# Altium schematic sheet CurrentLimiter.SchDoc
size A4; SheetNumber: 3; SheetTotal: 5
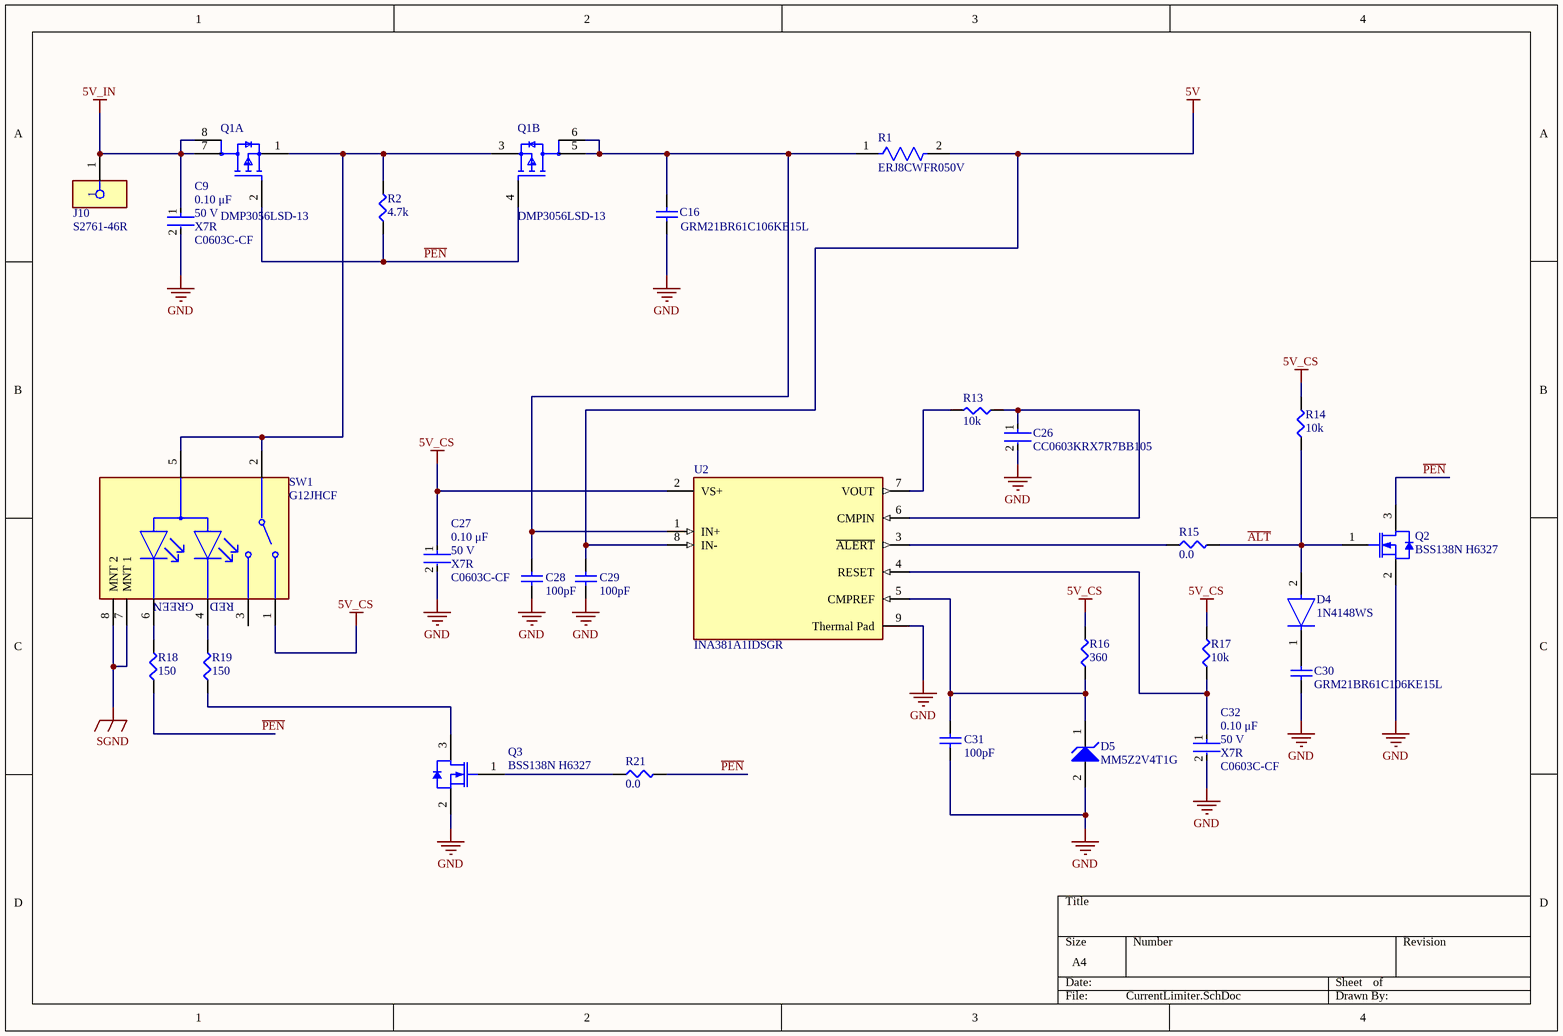
[diagram p0: CurrentLimiter.SchDoc]

## Parts
C9  value 0.10 μF  Package: C0603C-CF  Voltage Rating: 50 V  Temperature Characteristic: X7R  [FP-C0603C-CF-MFG]  (hidden comment: C0603C104K5RACTU)
C16  GRM21BR61C106KE15L  [CAPC2013X135X50LL10T20]
C26  CC0603KRX7R7BB105  [FP-CC0603-DA-MFG]
C27  value 0.10 μF  Package: C0603C-CF  Voltage Rating: 50 V  Temperature Characteristic: X7R  [FP-C0603C-CF-MFG]  (hidden comment: C0603C104K5RACTU)
C28  Capacitance: 100pF  [CAPC1608X90X40ML10T20]  (hidden comment: CC0603JRNPO9BN101)
C29  Capacitance: 100pF  [CAPC1608X90X40ML10T20]  (hidden comment: CC0603JRNPO9BN101)
C30  GRM21BR61C106KE15L  [CAPC2013X135X50LL10T20]
C31  Capacitance: 100pF  [CAPC1608X90X40ML10T20]  (hidden comment: CC0603JRNPO9BN101)
C32  value 0.10 μF  Package: C0603C-CF  Voltage Rating: 50 V  Temperature Characteristic: X7R  [FP-C0603C-CF-MFG]  (hidden comment: C0603C104K5RACTU)
D4  1N4148WS  [FP-477AB-IPC_C]
D5  MM5Z2V4T1G  [ONSC-SOD-523-2-502-01_V]
J10  S2761-46R  [FP-S2761-46R-MFG]
Q1  DMP3056LSD-13  [FP-SO-8-MFG]  (parts A,B of 2)
Q2  BSS138N H6327  [INF-PG-SOT-23-3_V]
Q3  BSS138N H6327  [INF-PG-SOT-23-3_V]
R1  ERJ8CWFR050V  [FP-ERJ8CW-IPC_B]
R2  4.7k  [SMD-0603-RES]
R13  10k  [SMD-0603-RES]
R14  10k  [SMD-0603-RES]
R15  0.0  [SMD-0603-RES]
R16  360  [SMD-0603-RES]
R17  10k  [SMD-0603-RES]
R18  150  [SMD-0603-RES]
R19  150  [SMD-0603-RES]
R21  0.0  [SMD-0603-RES]
SW1  G12JHCF  [FP-G12JHCF-MFG]
U2  INA381A1IDSGR  [FP-DSG0008A-IPC_A]

## Nets
5V: C29.2 R1.2 U2.8(IN-)
5V_CS: C27.1 R14.2 R16.2 R17.2 SW1.1 U2.2(VS+)
5V_IN: C9.1 J10.1 Q1.7(D1) Q1.8(D1)
GND: C9.2 C16.1 C26.2 C27.2 C28.1 C29.1 C30.1 C31.1 C32.2 D5.2(A) Q2.2(SOURCE) Q3.2(SOURCE) U2.9(Thermal_Pad)
SGND: SW1.7(MNT_1) SW1.8(MNT_2)
~{ALT}: D4.2(A) Q2.1(GATE) R14.1 R15.2
~{PEN}: Q1.2(G1) Q1.4(G2) Q2.3(DRAIN) R2.1 R18.1 R21.2
NetC16_2: C16.2 C28.2 Q1.5(D2) Q1.6(D2) R1.1 U2.1(IN+)
NetC26_1: C26.1 R13.1 U2.6(CMPIN)
NetC30_2: C30.2 D4.1(C)
NetC31_2: C31.2 D5.1(K) R16.1 U2.5(CMPREF)
NetC32_1: C32.1 R17.1 U2.4(RESET)
NetQ1_1: Q1.1(S1) Q1.3(S2) R2.2 SW1.2(COM) SW1.5(A)
NetQ3_1: Q3.1(GATE) R21.1
NetQ3_3: Q3.3(DRAIN) R19.1
NetR13_2: R13.2 U2.7(VOUT)
NetR15_1: R15.1 U2.3(~{ALERT})
NetR18_2: R18.2 SW1.6(GREEN_C)
NetR19_2: R19.2 SW1.4(RED_C)

Not connected (* = marked no-connect by the designer): SW1 3

## Notes on the sheet
- (near SW1) GREEN
- (near SW1) RED

## Library data of the parts
C9 C27 C32 = CMP-2006-03061-2: CAP CER 0.1UF 50V X7R 0603; Manufacturer: KEMET; Tolerance: 0.1; Temperature Coefficient: 30ppm/°C; Material: Ceramic; Automotive Grade: Grade 1; Temperature: -55°C to +125°C; RoHS: TRUE; Temperature Range High: +125°C; Lead Free: Yes; Octopart: https://octopart.com/c0603c104k5ractu-kemet-139244; Digikey Description: CAP CER 0.1UF 50V X7R 0603; Category: Cap; ComponentLink2Description: Datasheet; Temperature Range Low: -55°C; Device Class L1: Passive Components; Automotive: Yes; Device Class L3: Ceramic Capacitors; ComponentLink2URL: https://api.kemet.com/component-edge/download/datasheet/C0603C100J5GACAUTO.pdf; Capacitance: 0.10 μF; Device Class L2: Capacitors; Manufacturer Part Number: C0603C104K5RACTU; Height: 0.87mm
C16 C30 = CMP-2007-03453-1: Manufacturer: Murata; Part Number: GRM21BR61C106KE15L
C26 = CMP-03422-000924-1: CAP CER 1UF 16V X7R 0603; Manufacturer: YAGEO; Tolerance: 0.1; Description: CC0603 1 uF X7R 10.00% 16 V; Temperature Coefficient: 15%; Material: Ceramic; Package: CC0603-DA; RoHS: TRUE; Device Class L2: Capacitors; Temperature Characteristic: X7R; Temperature: -55°C to +125°C; Temperature Range Low: -55°C; Automotive: No; ComponentLink2Description: Datasheet; Value: 1 uF; Lead Free: Yes; Capacitance: 1 uF; ComponentLink2URL: http://www.yageo.com/documents/recent/UPY-GPHC_X7R_6.3V-to-50V_18.pdf; Device Class L1: Passive Components; Voltage: 16 V; Octopart: https://octopart.com/cc0603krx7r7bb105-yageo-42271928; Category: Cap; Digikey Description: CAP CER 1UF 16V X7R 0603; Footprint Url: http://www.yageo.com/exep/pages/download/literatures/UPY-C_GEN_24.pdf; Height: 0.9mm; Manufacturer Part Number: CC0603KRX7R7BB105; Voltage Rating: 16 V; Temperature Range High: +125°C; Mouser Description: Multilayer Ceramic Capacitor, CC Series, 1 - F, - 10%, X7R, 16 V, 0603 [1608 Metric]; Device Class L3: Ceramic Capacitors
C28 C29 C31 = CMP-2100-03594-1: Chip Capacitor, 100 pF, +/- 5%, 50 V, -55 to 125 degC, 0603 (1608 Metric), RoHS, Tape and Reel; Manufacturer: Yageo; Voltage Rating (DC): 50V; Dielectric: C0G; Temperature Coefficient: 30ppm/degC; Insulation Resistance: 100GR; Datasheet Version: Rev. 14, 07/2016; Manufacturer URL: http://www.yageo.com/; Packaging: TapeandReel; Mount: SurfaceMount; RoHSCompliant: True; Package Reference: 0603; Tolerance: 5%; Max Operating Temperature: 125degC; Case Code (Imperial): 0603; Number of Pins: 2; Width: 0.8mm; Case Code (Metric): 1608; Voltage: 50V; REACH SVHC: Unknown; Package Description: 2-Pin Surface Mount Device, Body 1.6 x 0.8 mm; Composition: Ceramic; Lead Free: LeadFree; Min Operating Temperature: -55degC; Radiation Hardening: No; Depth: 0.8mm; Thickness: 0.035inch; Datasheet URL: http://www.yageo.com/documents/recent/UPY-GP_NP0_16V-to-50V_14.pdf; Termination: SMD/SMT; Package Quantity: 1; Length: 1.6mm; Voltage Rating: 50V; Height: 0.8mm; Case/Package: 0603
D4 = CMP-07163-000040-1: DIODE GEN PURP 75V 150MA SOD323F; Recovery Time: 4ns; Element Configuration: Single; Max Forward Surge Current (Ifsm): 2A; Power Dissipation: 200mW; Forward Voltage: 1V; Peak Reverse Current: 5uA; Packaging: Tape and Reel; Min Operating Temperature: -55°C; Mount: Surface Mount; REACH SVHC: No SVHC; Lead Free: Lead Free; Length: 1.8mm; Radiation Hardening: No; Contact Plating: Tin; Max Operating Temperature: 150°C; Weight: 0.0276g; Reverse Voltage: 75V; Width: 1.35mm; Max Reverse Voltage (DC): 75V; Average Rectified Current: 150mA; Package Quantity: 1; Max Repetitive Reverse Voltage (Vrrm): 75V; Forward Current: 150mA; Height: 1mm; Reverse Recovery Time: 4ns; Number of Pins: 2
D5 = CMP-1060-00741-1: Zener Voltage Regulator, 500 mW, 2-Pin SOD-523, Pb-Free, Tape and Reel; Manufacturer: On Semiconductor; VZ Typ (V): 2.4; P Max (W): 0.5; DatasheetVersion: Rev. 10; PackageDescription: 2-Pin SOD, Body 1.2 x 0.8 mm; PackageVersion: Rev. E, 09/2010; ComponentLink2Description: Datasheet; ComponentLink1URL: http://www.onsemi.com/; ComponentLink2URL: http://www.onsemi.cn/pub_link/Collateral/MM5Z2V4T1-D.PDF; Mounting Technology: Surface Mount; ComponentLink1Description: Manufacturer URL; PackageReference: SOD-523-2-502-01; PartNumber: MM5Z2V4T1G; ComponentLink3Description: Package Specification; RoHS: Pb-Free; ComponentLink3URL: http://www.onsemi.com/pub_link/Collateral/502-01.PDF; Packing: Tape and Reel
J10 = CMP-15817-000011-1: PC TEST POINT NATURAL; Body Material: Brass; Plating: Tin; Mount: Surface Mount; Material: Copper Alloy; Packaging: Tape and Reel; Color: Natural; RoHS Compliant: Yes
Q1 = CMP-12801-000117-1: MOSFET 2P-CH 30V 6.9A 8-SOIC; Turn-Off Delay Time: 26.5ns; Turn-On Delay Time: 6.4ns; Number of Channels: 2; Drain to Source Resistance: 45mR; Gate to Source Voltage (Vgs): 20V; Max Power Dissipation: 2.5W; Rise Time: 5.3ns; Polarity: P-CHANNEL; Input Capacitance: 722pF; Fall Time: 14.7ns; Lead Free: Lead Free; Package Quantity: 2500; Mount: Surface Mount; Series: -; Height: 1.5mm; Radiation Hardening: No; Power Dissipation: 2.5W; Weight: 0.00261oz; Max Operating Temperature: 150°C; Drain to Source Voltage (Vdss): 30V; Rds On Max: 45mR; RoHS Compliant: Yes; Case/Package: SOP; Number of Elements: 2; Number of Pins: 8; REACH SVHC: No SVHC; Packaging: Tape and Reel; Min Operating Temperature: -55°C; Length: 5.3mm; Continuous Drain Current (ID): 6.9A; Width: 4.1mm
Q2 Q3 = CMP-2000-05967-1: N-Channel Small Signal MOSFET, 60 VDS, 0.23 A, -55 to 150 degC, 3-Pin SOT-23, RoHS, Tape and Reel; Manufacturer: InfineonTechnologiesAmericasInc.; Typical Turn-Off Delay Time: 6.7ns; Maximum Gate Source Voltage: ±20V; RDS-on: 3500@10VmOhm; Maximum Continuous Drain Current: 0.23A; Typical Rise Time: 3ns; Typical Fall Time: 8.2ns; Package Version: 12/2014; Typical Turn-On Delay Time: 2.3ns; Maximum Drain Source Voltage: 60V; Channel Mode: Enhancement; Package: 3SOT-23; Datasheet URL: https://datasheet.ciiva.com/4440/bss138n-rev2-86-88031-4440236.pdf; Manufacturer URL: http://www.infineon.com/; Mounting Technology: SurfaceMount; Datasheet Version: Rev. 2.86, 04/2012; Operating Temperature: -55to150°C; Package Description: 3-Pin Small Outline Transistor, Body 2.9 x 1.3 mm, Pitch 0.95 mm; Category: MOSFET; Package URL: http://www.infineon.com/dgdl/SOT23-Package_Overview.pdf?fileId=db3a30431936bc4b0119533468123c85; Mounting: SurfaceMount; Package Reference: PG-SOT-23-3
R1 = CMP-2003-00803-2: RES 0.05 OHM 1% 1W 1206
R2 = ERJ-3EKF4701V: RES SMD 4.7K OHM 1% 1/10W 0603; Manufacturer: Panasonic Electronic Components; Factory Stock: 0; Unit Price (USD): 0.00379; @ qty: 1500; Minimum Quantity: 1; Power (Watts): 0.1W, 1/10W; Temperature Coefficient: ±100ppm/°C; Part Number: ERJ-3EKF4701V; Datasheets: http://industrial.panasonic.com/www-cgi/jvcr13pz.cgi?E+PZ+3+AOA0002+ERJ3EKF4701V+7+WW; Image: //media.digikey.com/Photos/Panasonic%20Photos/MFG_ERJ-P6W%20Series.jpg; Digi-Key Part Number: P4.70KHCT-ND; Quantity Available: 999380; Packaging: Cut Tape (CT); Series: ERJ; Part Status: Active; Value: 4.7k; Tolerance: ±1%; Composition: Thick Film; Features: Automotive AEC-Q200; Operating Temperature: -55°C ~ 155°C; Package / Case: 0603 (1608 Metric); Supplier Device Package: 0603; Size / Dimension: 0.063" L x 0.031" W (1.60mm x 0.80mm); Height - Seated (Max): 0.022" (0.55mm); Number of Terminations: 2; Failure Rate: -
R13 R14 R17 = ERJ-3EKF1002V: RES SMD 10K OHM 1% 1/10W 0603; Manufacturer: Panasonic Electronic Components; Factory Stock: 0; Unit Price (USD): 0.00379; @ qty: 1500; Minimum Quantity: 1; Power (Watts): 0.1W, 1/10W; Temperature Coefficient: ±100ppm/°C; Part Number: ERJ-3EKF1002V; Datasheets: http://industrial.panasonic.com/www-cgi/jvcr13pz.cgi?E+PZ+3+AOA0002+ERJ3EKF1002V+7+WW; Image: //media.digikey.com/Photos/Panasonic%20Photos/MFG_ERJ-P6W%20Series.jpg; Digi-Key Part Number: P10.0KHCT-ND; Quantity Available: 6703141; Packaging: Cut Tape (CT); Series: ERJ; Part Status: Active; Value: 10k; Tolerance: ±1%; Composition: Thick Film; Features: Automotive AEC-Q200; Operating Temperature: -55°C ~ 155°C; Package / Case: 0603 (1608 Metric); Supplier Device Package: 0603; Size / Dimension: 0.063" L x 0.031" W (1.60mm x 0.80mm); Height - Seated (Max): 0.022" (0.55mm); Number of Terminations: 2; Failure Rate: -
R15 R21 = ERJ-3GEY0R00V: RES SMD 0.0OHM JUMPER 1/10W 0603; Manufacturer: Panasonic Electronic Components; Factory Stock: 0; Unit Price (USD): 0.00352; @ qty: 1500; Minimum Quantity: 1; Power (Watts): 0.1W, 1/10W; Part Number: ERJ-3GEY0R00V; Datasheets: http://industrial.panasonic.com/www-cgi/jvcr13pz.cgi?E+PZ+3+AOA0001+ERJ3GEY0R00V+7+WW; Image: //media.digikey.com/Photos/Panasonic%20Photos/MFG_ERJ-P6W%20Series.jpg; Digi-Key Part Number: P0.0GCT-ND; Quantity Available: 4813372; Packaging: Cut Tape (CT); Series: ERJ; Part Status: Active; Value: 0.0; Tolerance: Jumper; Composition: Thick Film; Features: Automotive AEC-Q200; Temperature Coefficient: -; Operating Temperature: -55°C ~ 155°C; Package / Case: 0603 (1608 Metric); Supplier Device Package: 0603; Size / Dimension: 0.063" L x 0.031" W (1.60mm x 0.80mm); Height - Seated (Max): 0.022" (0.55mm); Number of Terminations: 2; Failure Rate: -
R16 = ERJ-3EKF3600V: RES SMD 360 OHM 1% 1/10W 0603; Manufacturer: Panasonic Electronic Components; Factory Stock: 0; Unit Price (USD): 0.00379; @ qty: 1500; Minimum Quantity: 1; Power (Watts): 0.1W, 1/10W; Temperature Coefficient: ±100ppm/°C; Part Number: ERJ-3EKF3600V; Datasheets: http://industrial.panasonic.com/www-cgi/jvcr13pz.cgi?E+PZ+3+AOA0002+ERJ3EKF3600V+7+WW; Image: //media.digikey.com/Photos/Panasonic%20Photos/MFG_ERJ-P6W%20Series.jpg; Digi-Key Part Number: P360HCT-ND; Quantity Available: 85954; Packaging: Cut Tape (CT); Series: ERJ; Part Status: Active; Value: 360; Tolerance: ±1%; Composition: Thick Film; Features: Automotive AEC-Q200; Operating Temperature: -55°C ~ 155°C; Package / Case: 0603 (1608 Metric); Supplier Device Package: 0603; Size / Dimension: 0.063" L x 0.031" W (1.60mm x 0.80mm); Height - Seated (Max): 0.022" (0.55mm); Number of Terminations: 2; Failure Rate: -
R18 R19 = ERJ-3EKF1500V: RES SMD 150 OHM 1% 1/10W 0603; Manufacturer: Panasonic Electronic Components; Factory Stock: 0; Unit Price (USD): 0.00379; @ qty: 1500; Minimum Quantity: 1; Power (Watts): 0.1W, 1/10W; Temperature Coefficient: ±100ppm/°C; Part Number: ERJ-3EKF1500V; Datasheets: http://industrial.panasonic.com/www-cgi/jvcr13pz.cgi?E+PZ+3+AOA0002+ERJ3EKF1500V+7+WW; Image: //media.digikey.com/Photos/Panasonic%20Photos/MFG_ERJ-P6W%20Series.jpg; Digi-Key Part Number: P150HCT-ND; Quantity Available: 176295; Packaging: Cut Tape (CT); Series: ERJ; Part Status: Active; Value: 150; Tolerance: ±1%; Composition: Thick Film; Features: Automotive AEC-Q200; Operating Temperature: -55°C ~ 155°C; Package / Case: 0603 (1608 Metric); Supplier Device Package: 0603; Size / Dimension: 0.063" L x 0.031" W (1.60mm x 0.80mm); Height - Seated (Max): 0.022" (0.55mm); Number of Terminations: 2; Failure Rate: -
SW1 = CMP-31749-000003-1: SWITCH TOGGLE SPDT 0.4VA 28V; Illumination Type: Illuminated; Actuator Type: Standard Round; Contact Resistance: 80mR; Actuator Length: 3.8mm; Electrical Life: 100000Cycles; Switch Function: On-On; Contact Current Rating: 100mA; Actuator Material: Nylon; Insulation Resistance: 500MR; Number of Poles: 1; Depth: 14.22mm; Package Quantity: 1; Number of Pins: 1; Housing Material: Polyamide; Packaging: Bulk; REACH SVHC: No SVHC; Throw Configuration: SPDT; Height: 13.4mm; Series: G; Max Operating Temperature: 55°C; Orientation: Right Angle; Max Voltage Rating (DC): 28V; Lead Free: Lead Free; Termination: PC Pin; Switching Voltage: 28V; Color: Green; Length: 7.8mm; Width: 4.5mm; Mount: Through Hole; Contact Plating: Gold; Max Voltage Rating (AC): 28V; RoHS Compliant: Yes; Max Current Rating: 100mA; Voltage Rating (DC): 28V; Min Operating Temperature: -25°C; Contact Material: Bronze; Voltage Rating (AC): 28V
U2 = CMP-04895-000238-1: LOW COST CURRENT SENSOR WITH COM; Number of Channels: 1; Max Operating Temperature: 125°C; Min Operating Temperature: -40°C; RoHS Compliant: Yes